# Altium project GlassBoard.PrjPcb
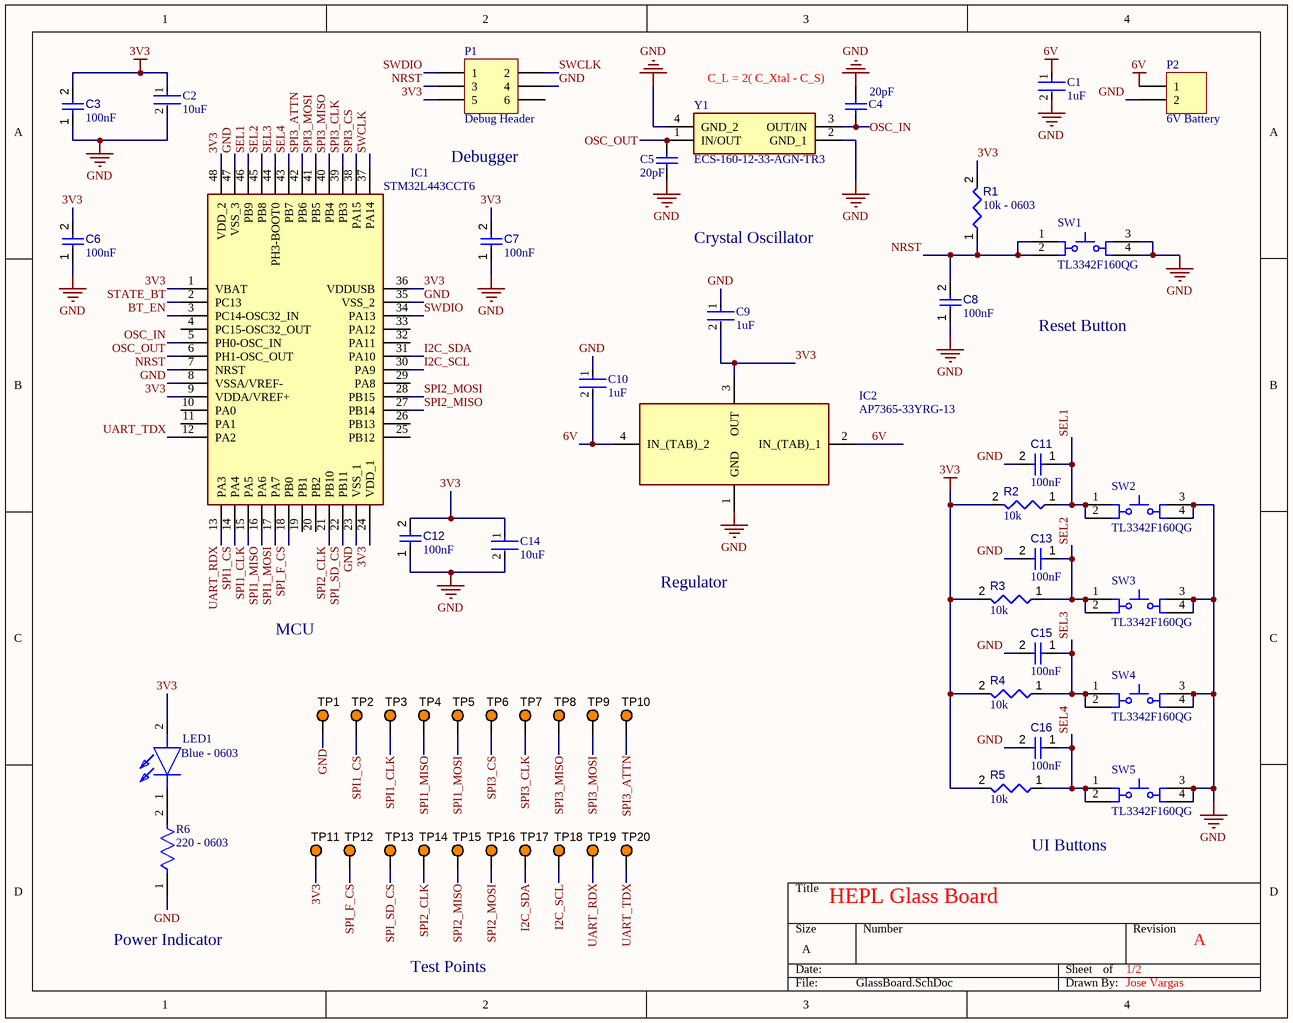
[diagram p0: GlassBoard.SchDoc]
2 sheets, 84 parts. Net scope: global (net labels, ports and power ports of the same name join across sheets).
Board file: GlassBoard.PcbDoc
Sheets:
  GlassBoard.SchDoc
  Peripherals.SchDoc

## Sheet GlassBoard.SchDoc
size A; SheetNumber: 1; SheetTotal: 2

### Parts
(Parts that share a designator on the sheet are numbered #1, #2 ... from top to bottom, then left to right.)
C1  1uF  [FP-CC0603-DA-MFG]
C2  10uF  [FP-GRM188-0_1-e0_2_0_55-IPC_A]
C3  value 100nF  [CAPC1608X90X40NL10T20]  (hidden comment: Capacitor 100 nF +/-10% 50 V 0603)
C4  20pF  [CAPC2013X140X50NL20T25]
C5  20pF  [CAPC2013X140X50NL20T25]
C6  value 100nF  [CAPC1608X90X40NL10T20]  (hidden comment: Capacitor 100 nF +/-10% 50 V 0603)
C7  value 100nF  [CAPC1608X90X40NL10T20]  (hidden comment: Capacitor 100 nF +/-10% 50 V 0603)
C8  value 100nF  [CAPC1608X90X40NL10T20]  (hidden comment: Capacitor 100 nF +/-10% 50 V 0603)
C9  1uF  [FP-CC0603-DA-MFG]
C10  1uF  [FP-CC0603-DA-MFG]
C11  value 100nF  [CAPC1608X90X40NL10T20]  (hidden comment: Capacitor 100 nF +/-10% 50 V 0603)
C12  value 100nF  [CAPC1608X90X40NL10T20]  (hidden comment: Capacitor 100 nF +/-10% 50 V 0603)
C13  value 100nF  [CAPC1608X90X40NL10T20]  (hidden comment: Capacitor 100 nF +/-10% 50 V 0603)
C14  10uF  [FP-GRM188-0_1-e0_2_0_55-IPC_A]
C15  value 100nF  [CAPC1608X90X40NL10T20]  (hidden comment: Capacitor 100 nF +/-10% 50 V 0603)
C16  value 100nF  [CAPC1608X90X40NL10T20]  (hidden comment: Capacitor 100 nF +/-10% 50 V 0603)
IC1  STM32L443CCT6  [QFP50P900X900X160-48N]
IC2#1  AP7365-33YRG-13  [AP736533YRG13]
LED1  Blue - 0603  [155060BS75300]
P1  Debug Header  [HDR2X3]
P2  6V Battery  [HDR1X2]
R1  value 10k - 0603  [RESC1608X55X25ML10T15]  (hidden comment: Resistor 10k +/-1% 0603 100 mW)
R2  value 10k  [RESC1608X55X25ML10T15]  (hidden comment: Resistor 10k +/-1% 0603 100 mW)
R3  value 10k  [RESC1608X55X25ML10T15]  (hidden comment: Resistor 10k +/-1% 0603 100 mW)
R4  value 10k  [RESC1608X55X25ML10T15]  (hidden comment: Resistor 10k +/-1% 0603 100 mW)
R5  value 10k  [RESC1608X55X25ML10T15]  (hidden comment: Resistor 10k +/-1% 0603 100 mW)
R6  220 - 0603  [FP-CRCW0603-e3-MFG]
SW1  TL3342F160QG  [ESWI-TL3342F160QG_V]
SW2  TL3342F160QG  [ESWI-TL3342F160QG_V]
SW3  TL3342F160QG  [ESWI-TL3342F160QG_V]
SW4  TL3342F160QG  [ESWI-TL3342F160QG_V]
SW5  TL3342F160QG  [ESWI-TL3342F160QG_V]
TP1  5003  [KSTN-5003]  (value not drawn)
TP2  5003  [KSTN-5003]  (value not drawn)
TP3  5003  [KSTN-5003]  (value not drawn)
TP4  5003  [KSTN-5003]  (value not drawn)
TP5  5003  [KSTN-5003]  (value not drawn)
TP6  5003  [KSTN-5003]  (value not drawn)
TP7  5003  [KSTN-5003]  (value not drawn)
TP8  5003  [KSTN-5003]  (value not drawn)
TP9  5003  [KSTN-5003]  (value not drawn)
TP10  5003  [KSTN-5003]  (value not drawn)
TP11  5003  [KSTN-5003]  (value not drawn)
TP12  5003  [KSTN-5003]  (value not drawn)
TP13  5003  [KSTN-5003]  (value not drawn)
TP14  5003  [KSTN-5003]  (value not drawn)
TP15  5003  [KSTN-5003]  (value not drawn)
TP16  5003  [KSTN-5003]  (value not drawn)
TP17  5003  [KSTN-5003]  (value not drawn)
TP18  5003  [KSTN-5003]  (value not drawn)
TP19  5003  [KSTN-5003]  (value not drawn)
TP20  5003  [KSTN-5003]  (value not drawn)
Y1  ECS-160-12-33-AGN-TR3  [ECS1601233AGNTR3]

### Nets
3V3: C2.1 C3.2 C6.2 C7.2 C9.2 C12.2 C14.1 IC1.1(VBAT) IC1.9(VDDA/VREF+) IC1.24(VDD_1) IC1.36(VDDUSB) IC1.48(VDD_2) IC2#1.3(OUT) LED1.2(A) P1.5 R1.2 R2.2 R3.2 R4.2 R5.2 TP11.1
6V: C1.1 C10.2 IC2#1.2(IN_(TAB)_1) IC2#1.4(IN_(TAB)_2) P2.1
GND: C1.2 C2.2 C3.1 C4.2 C5.1 C6.1 C7.1 C8.1 C9.1 C10.1 C11.2 C12.1 C13.2 C14.2 C15.2 C16.2 IC1.8(VSSA/VREF-) IC1.23(VSS_1) IC1.35(VSS_2) IC1.47(VSS_3) IC2#1.1(GND) P1.4 P2.2 R6.1 SW1.3 SW1.4 SW2.3 SW2.4 SW3.3 SW3.4 SW4.3 SW4.4 SW5.3 SW5.4 TP1.1 Y1.2(GND_1) Y1.4(GND_2)
BT_EN: IC1.3(PC14-OSC32_IN)
I2C_SCL: IC1.30(PA9) TP18.1
I2C_SDA: IC1.31(PA10) TP17.1
NRST: C8.2 IC1.7(NRST) P1.3 R1.1 SW1.1 SW1.2
OSC_IN: C4.1 IC1.5(PH0-OSC_IN) Y1.3(OUT/IN)
OSC_OUT: C5.2 IC1.6(PH1-OSC_OUT) Y1.1(IN/OUT)
SEL1: C11.1 IC1.46(PB9) R2.1 SW2.1 SW2.2
SEL2: C13.1 IC1.45(PB8) R3.1 SW3.1 SW3.2
SEL3: C15.1 IC1.44(PH3-BOOT0) R4.1 SW4.1 SW4.2
SEL4: C16.1 IC1.43(PB7) R5.1 SW5.1 SW5.2
SPI1_CLK: IC1.15(PA5) TP3.1
SPI1_CS: IC1.14(PA4) TP2.1
SPI1_MISO: IC1.16(PA6) TP4.1
SPI1_MOSI: IC1.17(PA7) TP5.1
SPI2_CLK: IC1.21(PB10) TP14.1
SPI2_MISO: IC1.27(PB14) TP15.1
SPI2_MOSI: IC1.28(PB15) TP16.1
SPI3_ATTN: IC1.42(PB6) TP10.1
SPI3_CLK: IC1.39(PB3) TP7.1
SPI3_CS: IC1.38(PA15) TP6.1
SPI3_MISO: IC1.40(PB4) TP8.1
SPI3_MOSI: IC1.41(PB5) TP9.1
SPI_F_CS: IC1.18(PB0) TP12.1
SPI_SD_CS: IC1.22(PB11) TP13.1
STATE_BT: IC1.2(PC13)
SWCLK: IC1.37(PA14) P1.2
SWDIO: IC1.34(PA13) P1.1
UART_RDX: IC1.13(PA3) TP19.1
UART_TDX: IC1.12(PA2) TP20.1
NetLED1_1: LED1.1(K) R6.2

Not connected (* = marked no-connect by the designer): IC1 4(PC15-OSC32_OUT) 10(PA0) 11(PA1) 19(PB1) 20(PB2) 25(PB12) 26(PB13) 29(PA8) 32(PA11) 33(PA12); P1 6

### Notes on the sheet
- (near C4) C_L = 2( C_Xtal - C_S)
- Debugger
- Crystal Oscillator
- Reset Button
- MCU
- Regulator
- HEPL Glass Board
- UI Buttons
- Power Indicator
- Test Points
- 1/2
- A
- Jose Vargas

### Library data of the parts
C1 C9 C10 = CMP-03422-000924-1: CAP CER 1UF 16V X7R 0603; Manufacturer: YAGEO; Manufacturer Part Number: CC0603KRX7R7BB105; Tolerance: 0.1; Temperature Coefficient: 15%; Material: Ceramic; Package: CC0603-DA; RoHS: TRUE; Device Class L2: Capacitors; Temperature Characteristic: X7R; Temperature: -55°C to +125°C; Temperature Range Low: -55°C; Automotive: No; ComponentLink2Description: Datasheet; Value: 1 uF; Lead Free: Yes; Capacitance: 1 uF; ComponentLink2URL: http://www.yageo.com/documents/recent/UPY-GPHC_X7R_6.3V-to-50V_18.pdf; Device Class L1: Passive Components; Voltage: 16 V; Octopart: https://octopart.com/cc0603krx7r7bb105-yageo-42271928; Category: Cap; Digikey Description: CAP CER 1UF 16V X7R 0603; Footprint Url: http://www.yageo.com/exep/pages/download/literatures/UPY-C_GEN_24.pdf; Height: 0.9mm; Voltage Rating: 16 V; Temperature Range High: +125°C; Mouser Description: Multilayer Ceramic Capacitor, CC Series, 1 - F, - 10%, X7R, 16 V, 0603 [1608 Metric]; Device Class L3: Ceramic Capacitors
C2 C14 = CMP-2006-02792-2: Chip Multilayer Ceramic Capacitors for General Purpose, 0603, 10uF, X5R, 15%, 20%, 6.3V; Packaging: Tape and Reel; Voltage Rating (DC): 6.3V; Width: 0.031inch; Termination: SMD/SMT; Dielectric: X5R; Package Quantity: 4000; Voltage Rating: 6.3V; Capacitance: 10uF; Case/Package: 0603; Min Operating Temperature: -55°C; Voltage: 6.3V; Length: 1.6mm; Thickness: 0.035inch; Lead Free: Lead Free; Depth: 0.8mm; Case Code (Imperial): 0603; Max Operating Temperature: 85°C; Material: Ceramic; Height: 0.8mm; Tolerance: 20%; Mount: Surface Mount; REACH SVHC: No SVHC; Radiation Hardening: No; Case Code (Metric): 1608
C3 C6-C8 C11-C13 C15 C16 = CMP-001-00017-6: Chip Capacitor, 100 nF, +/- 10%, 50 V, 0603 (1608 Metric); Voltage Rating: 50V; Capacitor Type: Ceramic; Tolerance: 10%; Mounting Technology: SM; Max Operating Temperature: 125°C; RoHS Compliant: True; Pins: 2; Case/Package: 0603; Min Operating Temperature: -55°C
C4 C5 = CMP-2007-04537-1: Part Number: 08051A200JAT2A; Manufacturer: AVX Interconnect / Elco
IC1 = STM32L443CCT6: Integrated Circuit; Manufacturer_Name: STMicroelectronics; Datasheet Link: https://componentsearchengine.com/Datasheets/2/STM32L443CCT6.pdf; Height: 1.6mm; Manufacturer_Part_Number: STM32L443CCT6; Mouser Part Number: 511-STM32L443CCT6; Mouser Price/Stock: https://www.mouser.co.uk/ProductDetail/STMicroelectronics/STM32L443CCT6?qs=dTJS0cRn7ohLPtZ3IeJ%2Fbg%3D%3D; Arrow Part Number: STM32L443CCT6; Arrow Price/Stock: https://www.arrow.com/en/products/stm32l443cct6/stmicroelectronics?region=nac
IC2#1 = AP7365-33YRG-13: Integrated Circuit; Manufacturer_Name: Diodes Inc.; Datasheet Link: https://componentsearchengine.com//AP7365-33YRG-13.pdf; Height: 1.6mm; Manufacturer_Part_Number: AP7365-33YRG-13; Mouser Part Number: 621-AP7365-33YRG-13; Mouser Price/Stock: https://www.mouser.co.uk/ProductDetail/Diodes-Incorporated/AP7365-33YRG-13?qs=abZ1nkZpTuM6iU77d8ddPA%3D%3D
LED1 = 155060BS75300: LED; Manufacturer_Name: Wurth Elektronik; Datasheet Link: https://www.mouser.fr/datasheet/2/445/155060BS75300-1838907.pdf; Height: 1mm; Manufacturer_Part_Number: 155060BS75300; Mouser Part Number: 710-155060BS75300; Mouser Price/Stock: https://www.mouser.co.uk/ProductDetail/Wurth-Elektronik/155060BS75300?qs=GedFDFLaBXFE8klTFAyuFA%3D%3D
P1 = Header 3X2: Header, 3-Pin, Dual row; LatestRevisionDate: 17-Jul-2002; LatestRevisionNote: Re-released for DXP Platform.; Publisher: Altium Limited
P2 = Header 2: Header, 2-Pin; LatestRevisionDate: 17-Jul-2002; LatestRevisionNote: Re-released for DXP Platform.; Publisher: Altium Limited
R1-R5 = CMP-009-00017-5: Chip Resistor, 10 KOhm, +/- 1%, 01 W, -55 to 155 degC, 0603 (1608 Metric); Voltage Rating: 50V; Power: 100mW; RoHS Compliant: True; Min Operating Temperature: -55°C; Pins: 2; Case/Package: 0603; Mounting Technology: SM; Max Operating Temperature: 155°C; Tolerance: 1%
R6 = CMP-2000-03085-2: RES Thick Film, 220Ω, 1%, 0.1W, 100ppm/°C, 0603; Power Rating: 100mW; Voltage Rating: 75V; Resistance: 220R; Contact Plating: Tin; Package Quantity: 10; Lead Free: Lead Free; Packaging: Tape and Reel; Max Operating Temperature: 155°C; Case/Package: 0603; Radiation Hardening: No; Height: 0.45mm; Width: 0.033inch; Case Code (Imperial): 0603; Number of Terminations: 2; Tolerance: 1%; Min Operating Temperature: -55°C; Termination: SMD/SMT; Length: 1.55mm; Features: Automotive AEC-Q200; Voltage Rating (DC): 75V; Case Code (Metric): 1608; Composition: Thick Film; Military Standard: Not; Temperature Coefficient: 100ppm/°C; Depth: 0.85mm; Weight: 7.1E-05oz; Max Power Dissipation: 100mW
SW1-SW5 = CMP-011-00008-2: Tactile Switch, SPST-NO, 50 mA, 12 V, 4-Pin SMD, RoHS, Tape and Reel; Manufacturer: E-Switch; Operating Force: 1.6N; Current Rating: 50mA; Throw Configuration: SPST; Max Voltage Rating (DC): 12V; Datasheet URL: http://spec_sheets.e-switch.com/specs/P010632.pdf; Manufacturer URL: http://www.e-switch.ch/en/; Mounting Technology: SM; Case/Package: TL3342F160QG; Package Quantity: 3000; Contact Material: Silver; Package Description: 4-Pin Surface Mount Device, Body 5 x 5 mm, Pitch 6.3 mm; Package Reference: TL3342F160QG; Datasheet Version: Rev. I, 12/2010; Voltage Rating (DC): 12V; Contact Plating: Silver; RoHS Compliant: True; Packaging: TapeandReel
TP1-TP20 = CMP-002-00037-2: Test Point, Orange, Height 4.6 mm, Tail Length 3 mm, 1-Pin THD, RoHS; Manufacturer: Keystone; Colour: Orange; Packaging: Bulk; Package Description: 1-Pin Through Hole Device, Dia 2.54 mm; Pins: 1; Package Reference: 5003; Datasheet Version: Jun-15; Case/Package: 5003; Mounting Technology: TH; Connector Type: TestPoint; Diameter: 2.54mm; Contact Material: Bronze; Datasheet URL: http://keyelco.com/userAssets/file/M65p56.pdf; Manufacturer URL: http://www.keyelco.com/; Package Quantity: 10; Contact Plating: Tin; RoHS Compliant: True
Y1 = ECS-160-12-33-AGN-TR3: Crystal or Oscillator; Manufacturer_Name: ECS; Datasheet Link: https://ecsxtal.com/store/pdf/ecx-32.pdf; Height: 0.8mm; Manufacturer_Part_Number: ECS-160-12-33-AGN-TR3; Mouser Part Number: 520-160-12-33AGN-TR3; Mouser Price/Stock: https://www.mouser.co.uk/ProductDetail/ECS/ECS-160-12-33-AGN-TR3?qs=e8oIoAS2J1R5dXUdgVaN0g%3D%3D; Arrow Part Number: ECS-160-12-33-AGN-TR3; Arrow Price/Stock: https://www.arrow.com/en/products/ecs-160-12-33-agn-tr3/ecs-international?region=nac

## Sheet Peripherals.SchDoc
size A; SheetNumber: 2; SheetTotal: 2
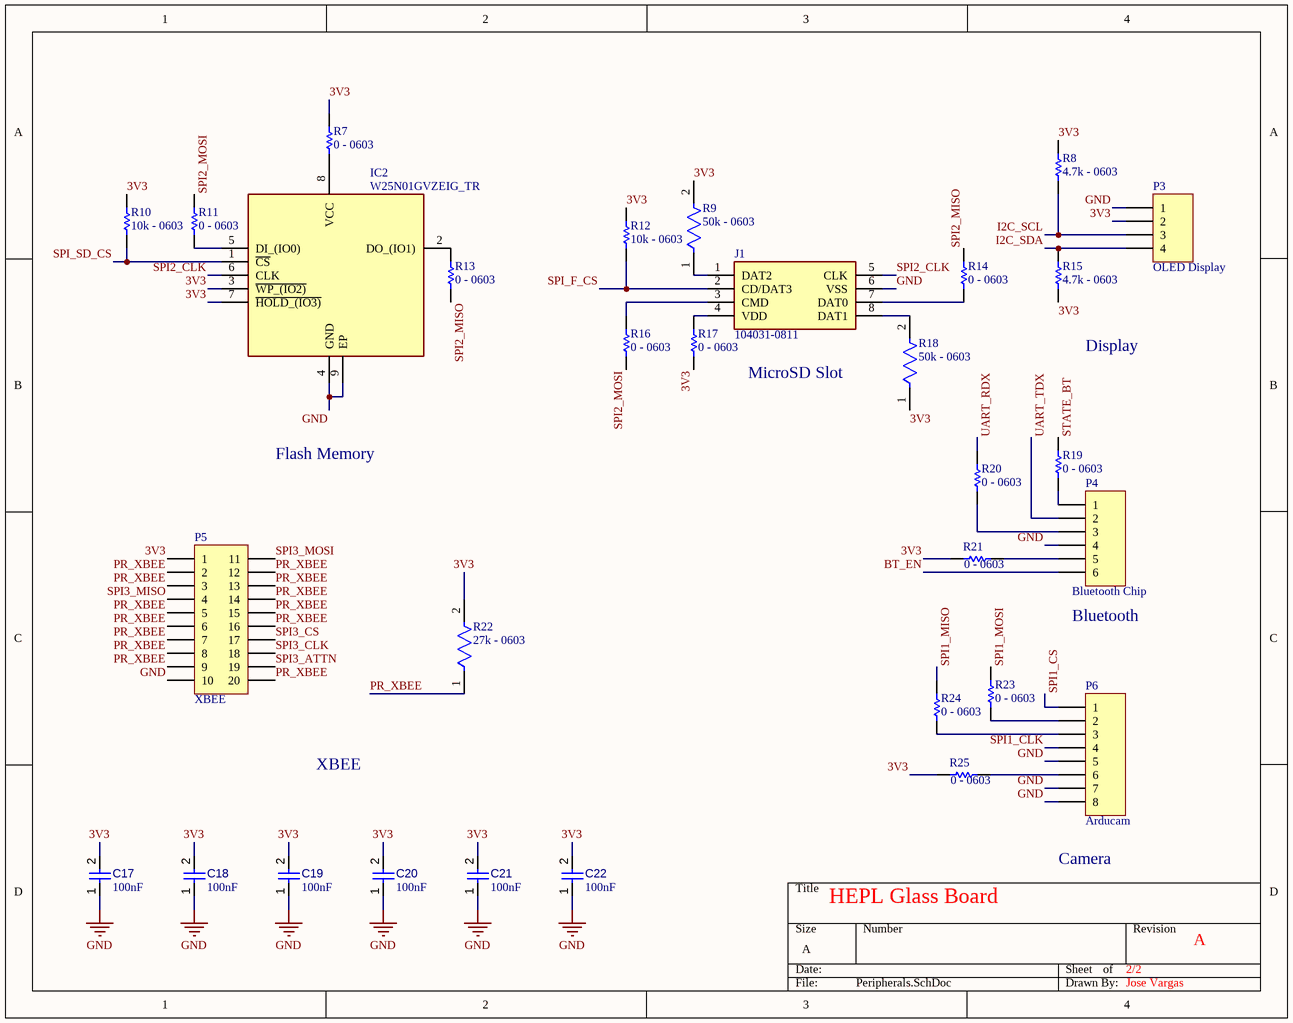
[diagram p1: Peripherals.SchDoc]

### Parts
(Parts that share a designator on the sheet are numbered #1, #2 ... from top to bottom, then left to right.)
C17  value 100nF  [CAPC1608X90X40NL10T20]  (hidden comment: Capacitor 100 nF +/-10% 50 V 0603)
C18  value 100nF  [CAPC1608X90X40NL10T20]  (hidden comment: Capacitor 100 nF +/-10% 50 V 0603)
C19  value 100nF  [CAPC1608X90X40NL10T20]  (hidden comment: Capacitor 100 nF +/-10% 50 V 0603)
C20  value 100nF  [CAPC1608X90X40NL10T20]  (hidden comment: Capacitor 100 nF +/-10% 50 V 0603)
C21  value 100nF  [CAPC1608X90X40NL10T20]  (hidden comment: Capacitor 100 nF +/-10% 50 V 0603)
C22  value 100nF  [CAPC1608X90X40NL10T20]  (hidden comment: Capacitor 100 nF +/-10% 50 V 0603)
IC2#2  W25N01GVZEIG_TR  [SON127P800X600X80-9N-D]
J1  104031-0811  [1040310811]
P3  OLED Display  [HDR1X4]
P4  Bluetooth Chip  [HDR1X6]
P5  XBEE  [HDR2X10_CEN]
P6  Arducam  [HDR1X8]
R7  0 - 0603  [RESC1608X55X25ML10T15]
R8  4.7k - 0603  [RESC1608X55X30NL15T15]
R9  50k - 0603  [FP-TNPU0603-e3-MFG]
R10  10k - 0603  [RESC1609X55X30LL15T15]
R11  0 - 0603  [RESC1608X55X25ML10T15]
R12  10k - 0603  [RESC1609X55X30LL15T15]
R13  0 - 0603  [RESC1608X55X25ML10T15]
R14  0 - 0603  [RESC1608X55X25ML10T15]
R15  4.7k - 0603  [RESC1608X55X30NL15T15]
R16  0 - 0603  [RESC1608X55X25ML10T15]
R17  0 - 0603  [RESC1608X55X25ML10T15]
R18  50k - 0603  [FP-TNPU0603-e3-MFG]
R19  0 - 0603  [RESC1608X55X25ML10T15]
R20  0 - 0603  [RESC1608X55X25ML10T15]
R21  0 - 0603  [RESC1608X55X25ML10T15]
R22  27k - 0603  [FP-CRCW0603-e3-IPC_A]
R23  0 - 0603  [RESC1608X55X25ML10T15]
R24  0 - 0603  [RESC1608X55X25ML10T15]
R25  0 - 0603  [RESC1608X55X25ML10T15]

### Nets
3V3: C17.2 C18.2 C19.2 C20.2 C21.2 C22.2 IC2#2.3(~{WP_(IO2)}) IC2#2.7(~{HOLD_(IO3)}) P3.2 P5.1 R7.1 R8.2 R9.2 R10.2 R12.2 R15.1 R17.2 R18.1 R21.1 R22.2 R25.1
GND: C17.1 C18.1 C19.1 C20.1 C21.1 C22.1 IC2#2.4(GND) IC2#2.9(EP) J1.6(VSS) P3.1 P4.4 P5.10 P6.5 P6.7 P6.8
BT_EN: P4.6
I2C_SCL: P3.3 R8.1
I2C_SDA: P3.4 R15.2
PR_XBEE: P5.2 P5.3 P5.5 P5.6 P5.7 P5.8 P5.9 P5.12 P5.13 P5.14 P5.15 P5.16 P5.20 R22.1
SPI1_CLK: P6.4
SPI1_CS: P6.1
SPI1_MISO: R24.2
SPI1_MOSI: R23.1
SPI2_CLK: IC2#2.6(CLK) J1.5(CLK)
SPI2_MISO: R13.2 R14.2
SPI2_MOSI: R11.1 R16.2
SPI3_ATTN: P5.19
SPI3_CLK: P5.18
SPI3_CS: P5.17
SPI3_MISO: P5.4
SPI3_MOSI: P5.11
SPI_F_CS: J1.2(CD/DAT3) R12.1
SPI_SD_CS: IC2#2.1(~{CS}) R10.1
STATE_BT: R19.1
UART_RDX: R20.1
UART_TDX: P4.2
NetIC2#2_2: IC2#2.2(DO_(IO1)) R13.1
NetIC2#2_5: IC2#2.5(DI_(IO0)) R11.2
NetIC2#2_8: IC2#2.8(VCC) R7.2
NetJ1_1: J1.1(DAT2) R9.1
NetJ1_3: J1.3(CMD) R16.1
NetJ1_4: J1.4(VDD) R17.1
NetJ1_7: J1.7(DAT0) R14.1
NetJ1_8: J1.8(DAT1) R18.2
NetP4_1: P4.1 R19.2
NetP4_3: P4.3 R20.2
NetP4_5: P4.5 R21.2
NetP6_2: P6.2 R23.2
NetP6_3: P6.3 R24.1
NetP6_6: P6.6 R25.2

### Notes on the sheet
- Display
- MicroSD Slot
- Flash Memory
- (near P4) Bluetooth
- XBEE
- HEPL Glass Board
- (near P6) Camera
- 2/2
- A
- Jose Vargas

### Library data of the parts
C17-C22 = CMP-001-00017-6: as C3 on sheet GlassBoard; Tolerance: 10%; Mounting Technology: SM; Max Operating Temperature: 125°C; RoHS Compliant: True; Pins: 2; Case/Package: 0603; Min Operating Temperature: -55°C
IC2#2 = W25N01GVZEIG_TR: Integrated Circuit; Manufacturer_Name: Winbond; Manufacturer_Part_Number: W25N01GVZEIG TR; Datasheet Link: https://www.winbond.com/resource-files/w25n01gv revg 032116.pdf; Height: 0.8mm; Mouser Part Number: 454-W25N01GVZEIGTR; Mouser Price/Stock: https://www.mouser.co.uk/ProductDetail/Winbond/W25N01GVZEIG-TR?qs=qSfuJ%252Bfl%2Fd6niBi0Qz1MPg%3D%3D; Arrow Part Number: W25N01GVZEIG TR; Arrow Price/Stock: https://www.arrow.com/en/products/w25n01gvzeigtr/winbond-electronics?region=nac
J1 = 104031-0811: Connector; Manufacturer_Name: Molex; Datasheet Link: http://www.molex.com/webdocs/datasheets/pdf/en-us/1040310811_MEMORY_CARD_SOCKET.pdf; Manufacturer_Part_Number: 104031-0811; Mouser Part Number: 538-104031-0811; Mouser Price/Stock: https://www.mouser.co.uk/ProductDetail/Molex/104031-0811?qs=udsGRKD4nA3Tvy7wqky%252BuA%3D%3D
P3 = Header 4: Header, 4-Pin; LatestRevisionDate: 17-Jul-2002; LatestRevisionNote: Re-released for DXP Platform.; Publisher: Altium Limited
P4 = Header 6: Header, 6-Pin; LatestRevisionDate: 17-Jul-2002; LatestRevisionNote: Re-released for DXP Platform.; Publisher: Altium Limited
P5 = Header 10X2A: Header, 10-Pin, Dual row; LatestRevisionDate: 17-Jul-2002; LatestRevisionNote: Re-released for DXP Platform.; Publisher: Altium Limited
P6 = Header 8: Header, 8-Pin; LatestRevisionDate: 17-Jul-2002; LatestRevisionNote: Re-released for DXP Platform.; Publisher: Altium Limited
R7 R11 R13 R14 R16 R17 R19-R21 R23-R25 = CMP-2100-03667-1: Chip Resistor, 0 Ohm, +/- 5%, 0.1 W, -55 to 155 degC, 0603 (1608 Metric), RoHS, Tape and Reel; Manufacturer: Yageo; Temperature Coefficient: 200ppm/degreesC; Voltage Rating: 50V; Power Rating: 100mW; Resistance: 0mOhm; Width: 0.8mm; Max Operating Temperature: 155degC; Tolerance: 5%; Package Reference: 0603; Height: 0.45mm; Depth: 0.8mm; Package Description: 2-Pin Surface Mount Device, Body 1.6 x 0.8 mm; Termination: SMD/SMT; Package Quantity: 5000; Case/Package: 0603; Case Code (Imperial): 0603; Radiation Hardening: No; Number of Pins: 2; Length: 1.6mm; Lead Free: LeadFree; Voltage Rating (DC): 50V; Military Standard: Not; Datasheet URL: http://www.yageo.com/NewPortal/yageodocoutput?fileName=/pdf/R-Chip/PYu-RC_Group_51_RoHS_L_5.pdf; Manufacturer URL: http://www.yageo.com/; Packaging: TapeandReel; Case Code (Metric): 1608; Min Operating Temperature: -55degC; Composition: ThickFilm; RoHSCompliant: true; Contact Plating: Tin; Datasheet Version: Rev. 5, 10/2016; REACH SVHC: NoSVHC
R8 R15 = CMP-1012-00586-3: Precision Thick Film Chip Resistor, 4.7 KOhm, +/- 1%, -55 to 155 degC, 0603 (1608 Metric), RoHS, Tape and Reel; Resistance: 220 Ohm; Voltage Rating: 50 V; Elements: 4; Case\Package: 1205; Tolerance: 5%; Power Rating: 250 mW; PackageReference: 0603; Max Operating Temperature: 125 degC; REACH SVHC: No SVHC; Width: 0.063 inch; Length: 0.126 inch; Height: 0.024 inch; Mount: Surface Mount; Package Quantity: 1; DatasheetVersion: Apr-15; ComponentLink1Description: Manufacturer URL; Min Operating Temperature: -55 degC; Packaging: Tape and Reel; Radiation Hardening: No; ComponentLink2URL: http://industrial.panasonic.com/cdbs/www-data/pdf/RDA0000/AOA0000C86.pdf; Case Code (Metric): 3216; Pins: 8; Case Code (Imperial): 1206; Type (Resistor): Thick Film; RoHSCompliant: true; ComponentLink2Description: Datasheet; PackageDescription: 2-Pin Surface Mount Device, Body 1.6 x 0.85 mm; ComponentLink1URL: http://www.panasonic.com/
R9 R18 = CMP-02407-013067-1: RES SMD 50K OHM 0.02% 1/10W 0603; Temperature Coefficient: 5ppm/°C; Max Power Dissipation: 100mW; Resistance: 50kR; Max Operating Temperature: 125°C; Min Operating Temperature: -55°C; Case Code (Metric): 1608; Features: Moisture Resistant; Resistor Type: Thin Film; Packaging: Cut Tape; Case/Package: 0603; Tolerance: 0.02%; Number of Terminations: 2; Case Code (Imperial): 0603
R10 R12 = CMP-1012-00623-3: Chip Resistor, 10 KOhm, +/- 1%, 0.1 W, -55 to 155 degC, 0603 (1608 Metric), RoHS, Tape and Reel; Manufacturer: Panasonic; Voltage Rating: 75V; Case\/Package: 0603; Power Rating: 100mW; Resistance: 10KOhm; Temperature Coefficient: 100ppm\/degreesC; Number of Pins: 2; Package Reference: 603; Depth: 0.8mm; Mount: SurfaceMount; Package Description: 2-Pin Surface Mount Device, Body 1.6 x 0.85 mm; Datasheet Version: 02/2017; Length: 1.6mm; Lead Free: LeadFree; Height: 0.45mm; Number of Terminations: 2; Max Power Dissipation: 100mW; Min Operating Temperature: -55degC; Datasheet URL: https://industrial.panasonic.com/cdbs/www-data/pdf/RDA0000/AOA0000C304.pdf; Termination: SMD/SMT; Case Code (Metric): 1608; Case Code (Imperial): 0603; Tolerance: 1%; Max Operating Temperature: 155degC; RoHSCompliant: true; Voltage Rating (DC): 75V; Radiation Hardening: No; Packaging: TapeandReel; Composition: ThickFilm; Mounting Technology: SurfaceMount; Manufacturer URL: http://www.panasonic.com/; Width: 0.031inch; REACH SVHC: NoSVHC; Contact Plating: Tin; Military Standard: Not; Package Quantity: 1
R22 = CMP-1012-00670-3: RES Thick Film, 27kΩ, 1%, 0.1W, 100ppm/°C, 0603; Resistance: 27kR; Voltage Rating (DC): 75V; Power Rating: 100mW; Military Standard: Not; Termination: SMD/SMT; Tolerance: 1%; Min Operating Temperature: -55°C; Package Quantity: 10; Width: 0.85mm; Radiation Hardening: No; Length: 1.55mm; Case/Package: 0603; Number of Terminations: 2; Contact Plating: Tin; Number of Pins: 2; Composition: Thick Film; Depth: 0.85mm; Mount: Surface Mount; Max Operating Temperature: 155°C; Weight: 7.1E-05oz; Voltage Rating: 75V; Packaging: Tape and Reel; Case Code (Imperial): 0603; Temperature Coefficient: 100ppm/°C; Height: 0.45mm; Lead Free: Lead Free; Case Code (Metric): 1608; Max Power Dissipation: 100mW; Features: Automotive AEC-Q200

## Nets that join several sheets
3V3: GlassBoard (21 pins), Peripherals (21 pins)
GND: GlassBoard (37 pins), Peripherals (15 pins)
BT_EN: GlassBoard (IC1.3), Peripherals (P4.6)
I2C_SCL: GlassBoard (IC1.30 TP18.1), Peripherals (P3.3 R8.1)
I2C_SDA: GlassBoard (IC1.31 TP17.1), Peripherals (P3.4 R15.2)
SPI1_CLK: GlassBoard (IC1.15 TP3.1), Peripherals (P6.4)
SPI1_CS: GlassBoard (IC1.14 TP2.1), Peripherals (P6.1)
SPI1_MISO: GlassBoard (IC1.16 TP4.1), Peripherals (R24.2)
SPI1_MOSI: GlassBoard (IC1.17 TP5.1), Peripherals (R23.1)
SPI2_CLK: GlassBoard (IC1.21 TP14.1), Peripherals (IC2#2.6 J1.5)
SPI2_MISO: GlassBoard (IC1.27 TP15.1), Peripherals (R13.2 R14.2)
SPI2_MOSI: GlassBoard (IC1.28 TP16.1), Peripherals (R11.1 R16.2)
SPI3_ATTN: GlassBoard (IC1.42 TP10.1), Peripherals (P5.19)
SPI3_CLK: GlassBoard (IC1.39 TP7.1), Peripherals (P5.18)
SPI3_CS: GlassBoard (IC1.38 TP6.1), Peripherals (P5.17)
SPI3_MISO: GlassBoard (IC1.40 TP8.1), Peripherals (P5.4)
SPI3_MOSI: GlassBoard (IC1.41 TP9.1), Peripherals (P5.11)
SPI_F_CS: GlassBoard (IC1.18 TP12.1), Peripherals (J1.2 R12.1)
SPI_SD_CS: GlassBoard (IC1.22 TP13.1), Peripherals (IC2#2.1 R10.1)
STATE_BT: GlassBoard (IC1.2), Peripherals (R19.1)
UART_RDX: GlassBoard (IC1.13 TP19.1), Peripherals (R20.1)
UART_TDX: GlassBoard (IC1.12 TP20.1), Peripherals (P4.2)